# EAGLE design LCD 2X16 (EAGLE 5.06)
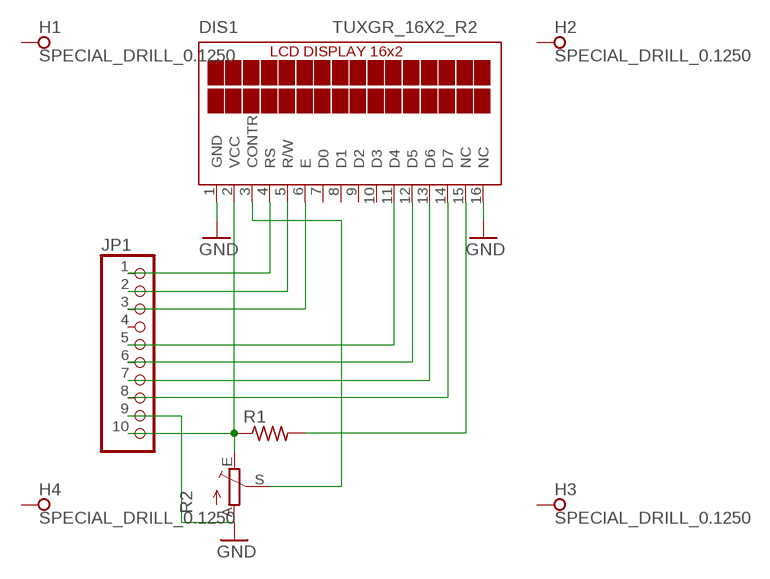
[diagram p0: schematic, sheet 1]

## Parts
DIS1  TUXGR_16X2_R2  [TUXGR_16X2_R2]
H1  SPECIAL_DRILL_0.1250  [PAD_0.1250]
H2  SPECIAL_DRILL_0.1250  [PAD_0.1250]
H3  SPECIAL_DRILL_0.1250  [PAD_0.1250]
H4  SPECIAL_DRILL_0.1250  [PAD_0.1250]
JP1  PINHD-1X10  [1X10]
R1  R-US_0309/10  [0309/10]
R2  TRIM_EU-LI10  [LI10]

## Nets
GND: DIS1.1(GND) DIS1.16(NC) JP1.9 R2.A
N$1: DIS1.2(VCC) JP1.10 R1.1 R2.E
N$2: DIS1.15(NC) R1.2
N$3: DIS1.14(D7) JP1.8
N$4: DIS1.13(D6) JP1.7
N$5: DIS1.12(D5) JP1.6
N$6: DIS1.11(D4) JP1.5
N$7: DIS1.4(RS) JP1.1
N$8: DIS1.5(R/W) JP1.2
N$9: DIS1.6(E) JP1.3
N$10: DIS1.3(CONTR) R2.S
Unconnected: DIS1.7(D0) DIS1.8(D1) DIS1.9(D2) DIS1.10(D3) H1.1 H2.1 H3.1 H4.1 JP1.4

## Library data of the parts
DIS1 = display-lcd:TUXGR_16X2_R2: Tuxgraphics LCD display 16x2 characters reflective, without background light Source: tuxgr_12x2_r2.pdf
H1-H4 = special-drill:SPECIAL_DRILL_: Special drills
JP1 = pinhead:PINHD-1X10: PIN HEADER
R1 = resistor:R-US_: RESISTOR, American symbol
R2 = pot:TRIM_EU-: POTENTIOMETER

## Board
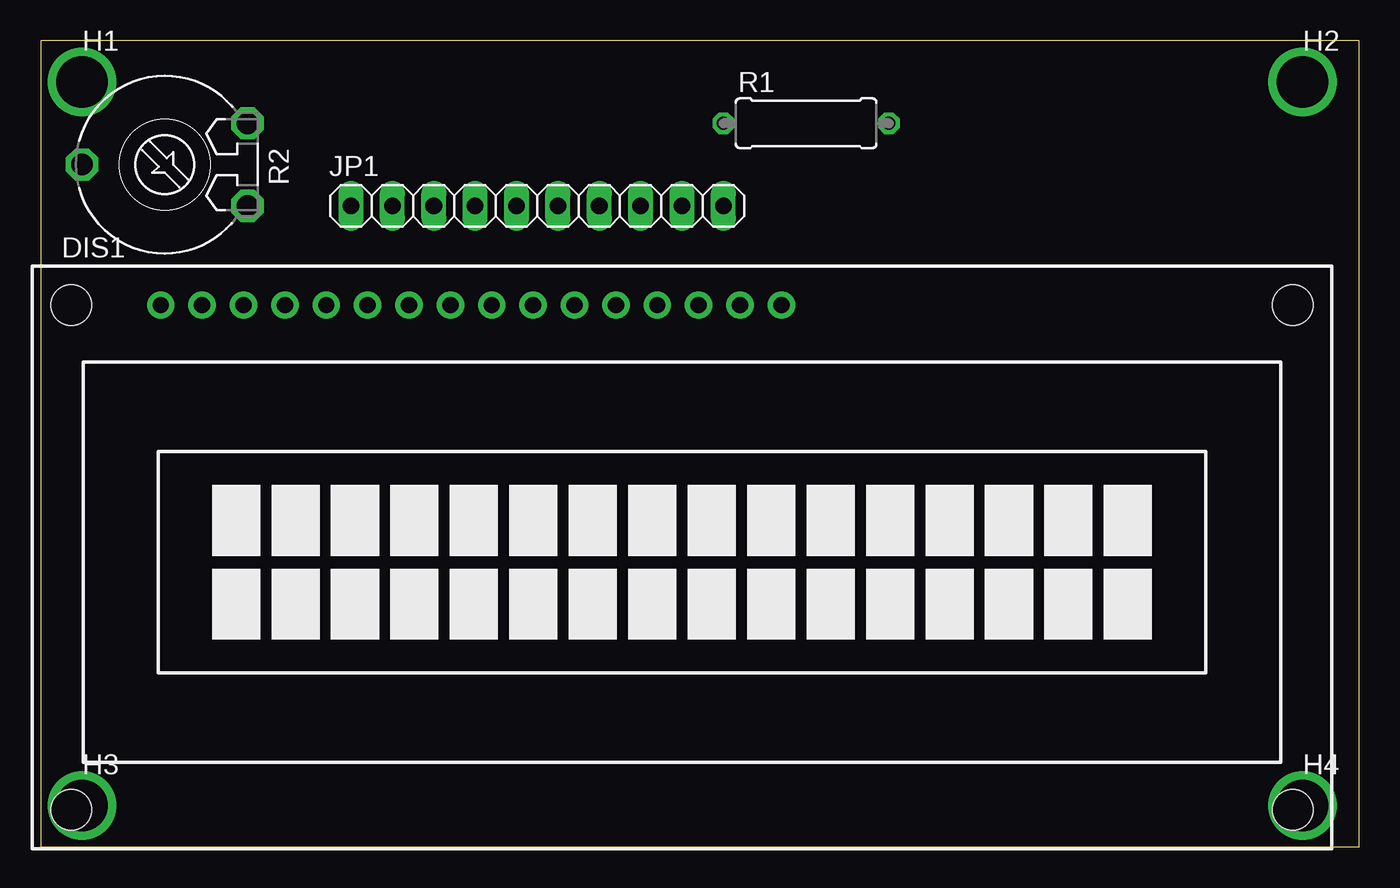
[diagram p1: board, top side]
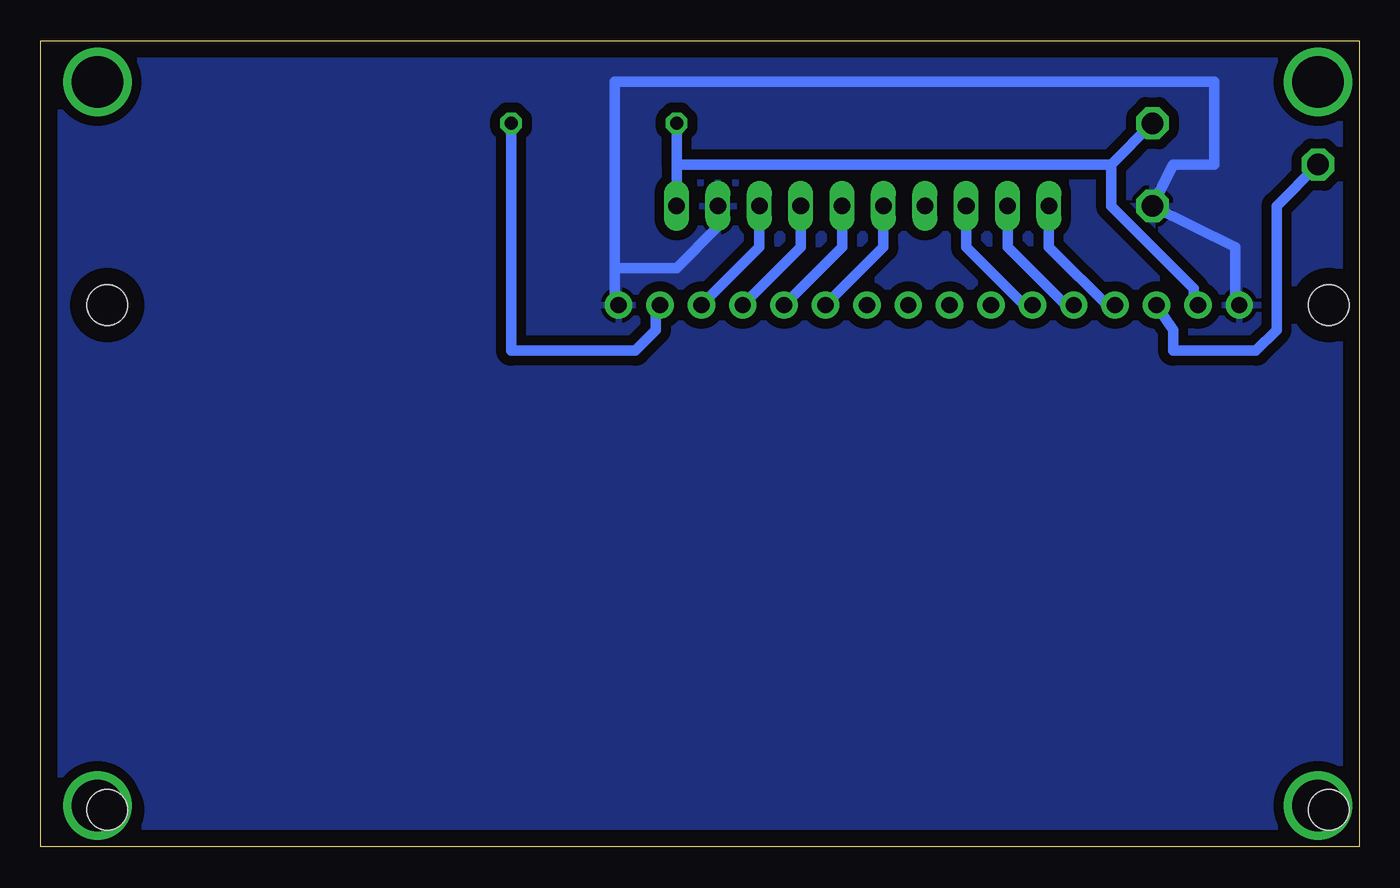
[diagram p2: board, bottom side, seen from below]

Size 80.95 x 49.52 mm. Coordinates in mm from the lower left corner, seen from the top.
Outline: 0,0 80.95,0 80.95,49.52 0,49.52 0,0
Copper layers (1*16): Top 0.035mm / dielectric 1.5mm / Bottom 0.035mm
Design rules "default *": minimum track width 25mil, minimum drill 24mil, track to track 10mil, track to pad 10mil, pad to pad 10mil, via to via 10mil, smd to smd 8mil, copper to edge 40mil, drill to drill 8mil, minimum pad ring 10mil, minimum via ring 8mil, stop-mask expansion 4mil, vias tented up to drill 0mil, thermal gap 10mil

### Footprints (pad centres in the part's own frame; a part is rotated, then mirrored left to right if it is on the bottom)
TUXGR_16X2_R2 = drill 1 pad 1.676 round: 1 -32,15.5; 2 -29.46,15.5; 3 -26.92,15.5; 4 -24.38,15.5; 5 -21.84,15.5; 6 -19.3,15.5; 7 -16.76,15.5; 8 -14.22,15.5; 9 -11.68,15.5; 10 -9.14,15.5; 11 -6.6,15.5; 12 -4.06,15.5; 13 -1.52,15.5; 14 1.02,15.5; 15 3.56,15.5; 16 6.1,15.5 | hole 2.5: -37.5,-15.5; 37.5,-15.5; -37.5,15.5; 37.5,15.5
PAD_0.1250 = drill 3.175 pad 3.175 round: 1 0,0
1X10 = drill 1.016 long: 1 -11.43,0; 2 -8.89,0; 3 -6.35,0; 4 -3.81,0; 5 -1.27,0; 6 1.27,0; 7 3.81,0; 8 6.35,0; 9 8.89,0; 10 11.43,0
0309/10 = drill 0.813 octagon: 1 -5.08,0; 2 5.08,0
LI10 = drill 1.321 octagon: A -2.54,-5.08; E 2.54,-5.08; S 0,5.08

### Placement (x,y rotation side)
DIS1  39.37,17.78 0 top
H1  2.54,46.99 0 top
H2  77.47,46.99 0 top
H3  2.54,2.54 0 top
H4  77.47,2.54 0 top
JP1  30.48,39.37 0 top
R1  46.99,44.45 0 top
R2  7.62,41.91 90 top

### Tracks (layer width: path | path; a pad name or v marks a point on that pad's centre or on a via)
GND
  Bottom 0.635: JP1.9 39.37,38.1 41.91,35.56 45.72,35.56 45.72,34.29 | 45.72,34.29 45.72,33.02 DIS1.16 | DIS1.1 7.62,33.02 7.62,36.83 R2.A 11.43,41.91 8.89,41.91 8.89,46.99 45.72,46.99 45.72,34.29
  pour Bottom (isolate 0.61): 0,49.53 80.01,49.53 80.01,0 0,0
N$1
  Bottom 0.635: 41.91,41.91 JP1.10 | 41.91,41.91 R1.1 | 15.24,41.91 15.24,39.37 10.16,34.29 10.16,33.02 DIS1.2 | 15.24,41.91 R2.E | 15.24,41.91 41.91,41.91
N$2
  Bottom 0.635: R1.2 52.07,30.48 44.45,30.48 43.18,31.75 43.18,33.02 DIS1.15
N$3
  Bottom 0.635: JP1.8 36.83,36.83 40.64,33.02 DIS1.14
N$4
  Bottom 0.635: JP1.7 34.29,36.83 38.1,33.02 DIS1.13
N$5
  Bottom 0.635: JP1.6 31.75,36.83 35.56,33.02 DIS1.12
N$6
  Bottom 0.635: JP1.5 29.21,36.83 33.02,33.02 DIS1.11
N$7
  Bottom 0.635: JP1.1 19.05,36.83 15.24,33.02 DIS1.4
N$8
  Bottom 0.635: JP1.2 21.59,36.83 17.78,33.02 DIS1.5
N$9
  Bottom 0.635: JP1.3 24.13,36.83 20.32,33.02 DIS1.6
N$10
  Bottom 0.635: R2.S 5.08,39.37 5.08,31.75 6.35,30.48 11.43,30.48 11.43,31.75 DIS1.3